# EasyEDA Pro project sfy3-v3.1.4.epro, schematic sfy3

## Sheets
1 Notecard, Antennas: Page Name: P1; Project Name: Project Name; Schematic Name: Schematic Name; Update Date: 2021.11.05; Company: EasyEDA.com; Drawn: EasyEDA; Page Size: A4; Part Number: JLCPCB-002; Reviewed: EasyEDA; Version: V0.1
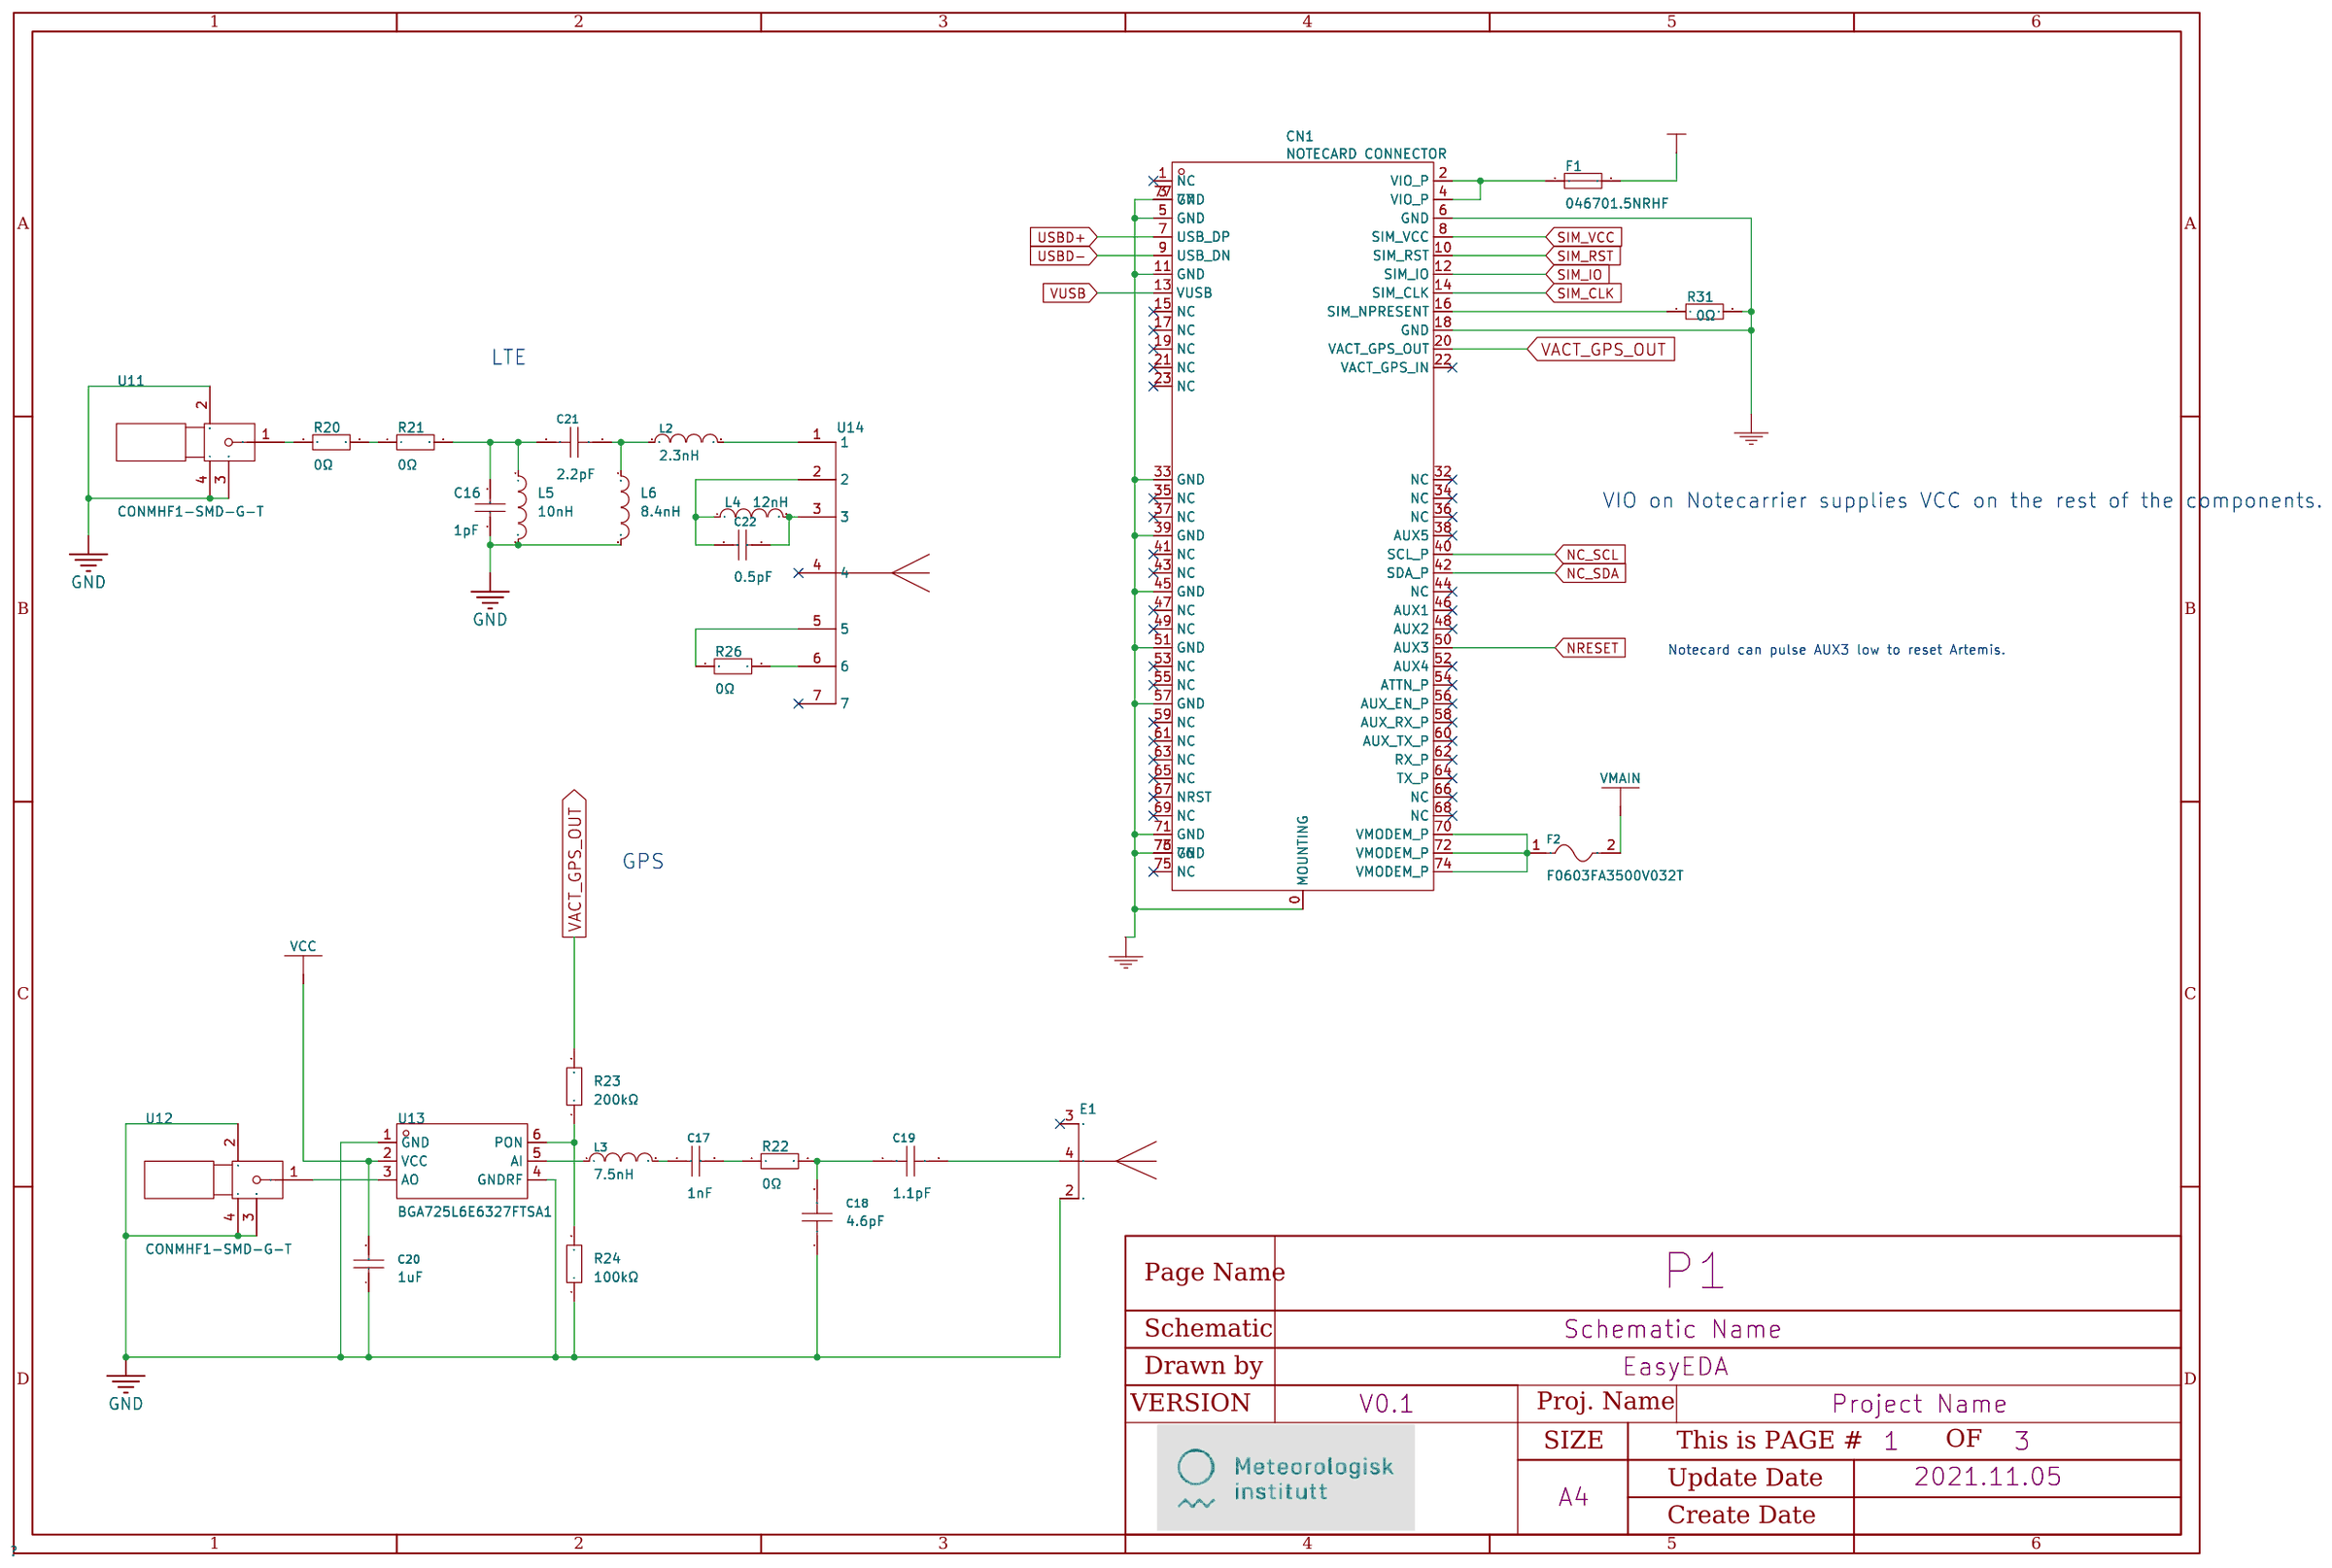
[diagram p0: Notecard, Antennas]
2 IMU, Thermistor, SD card
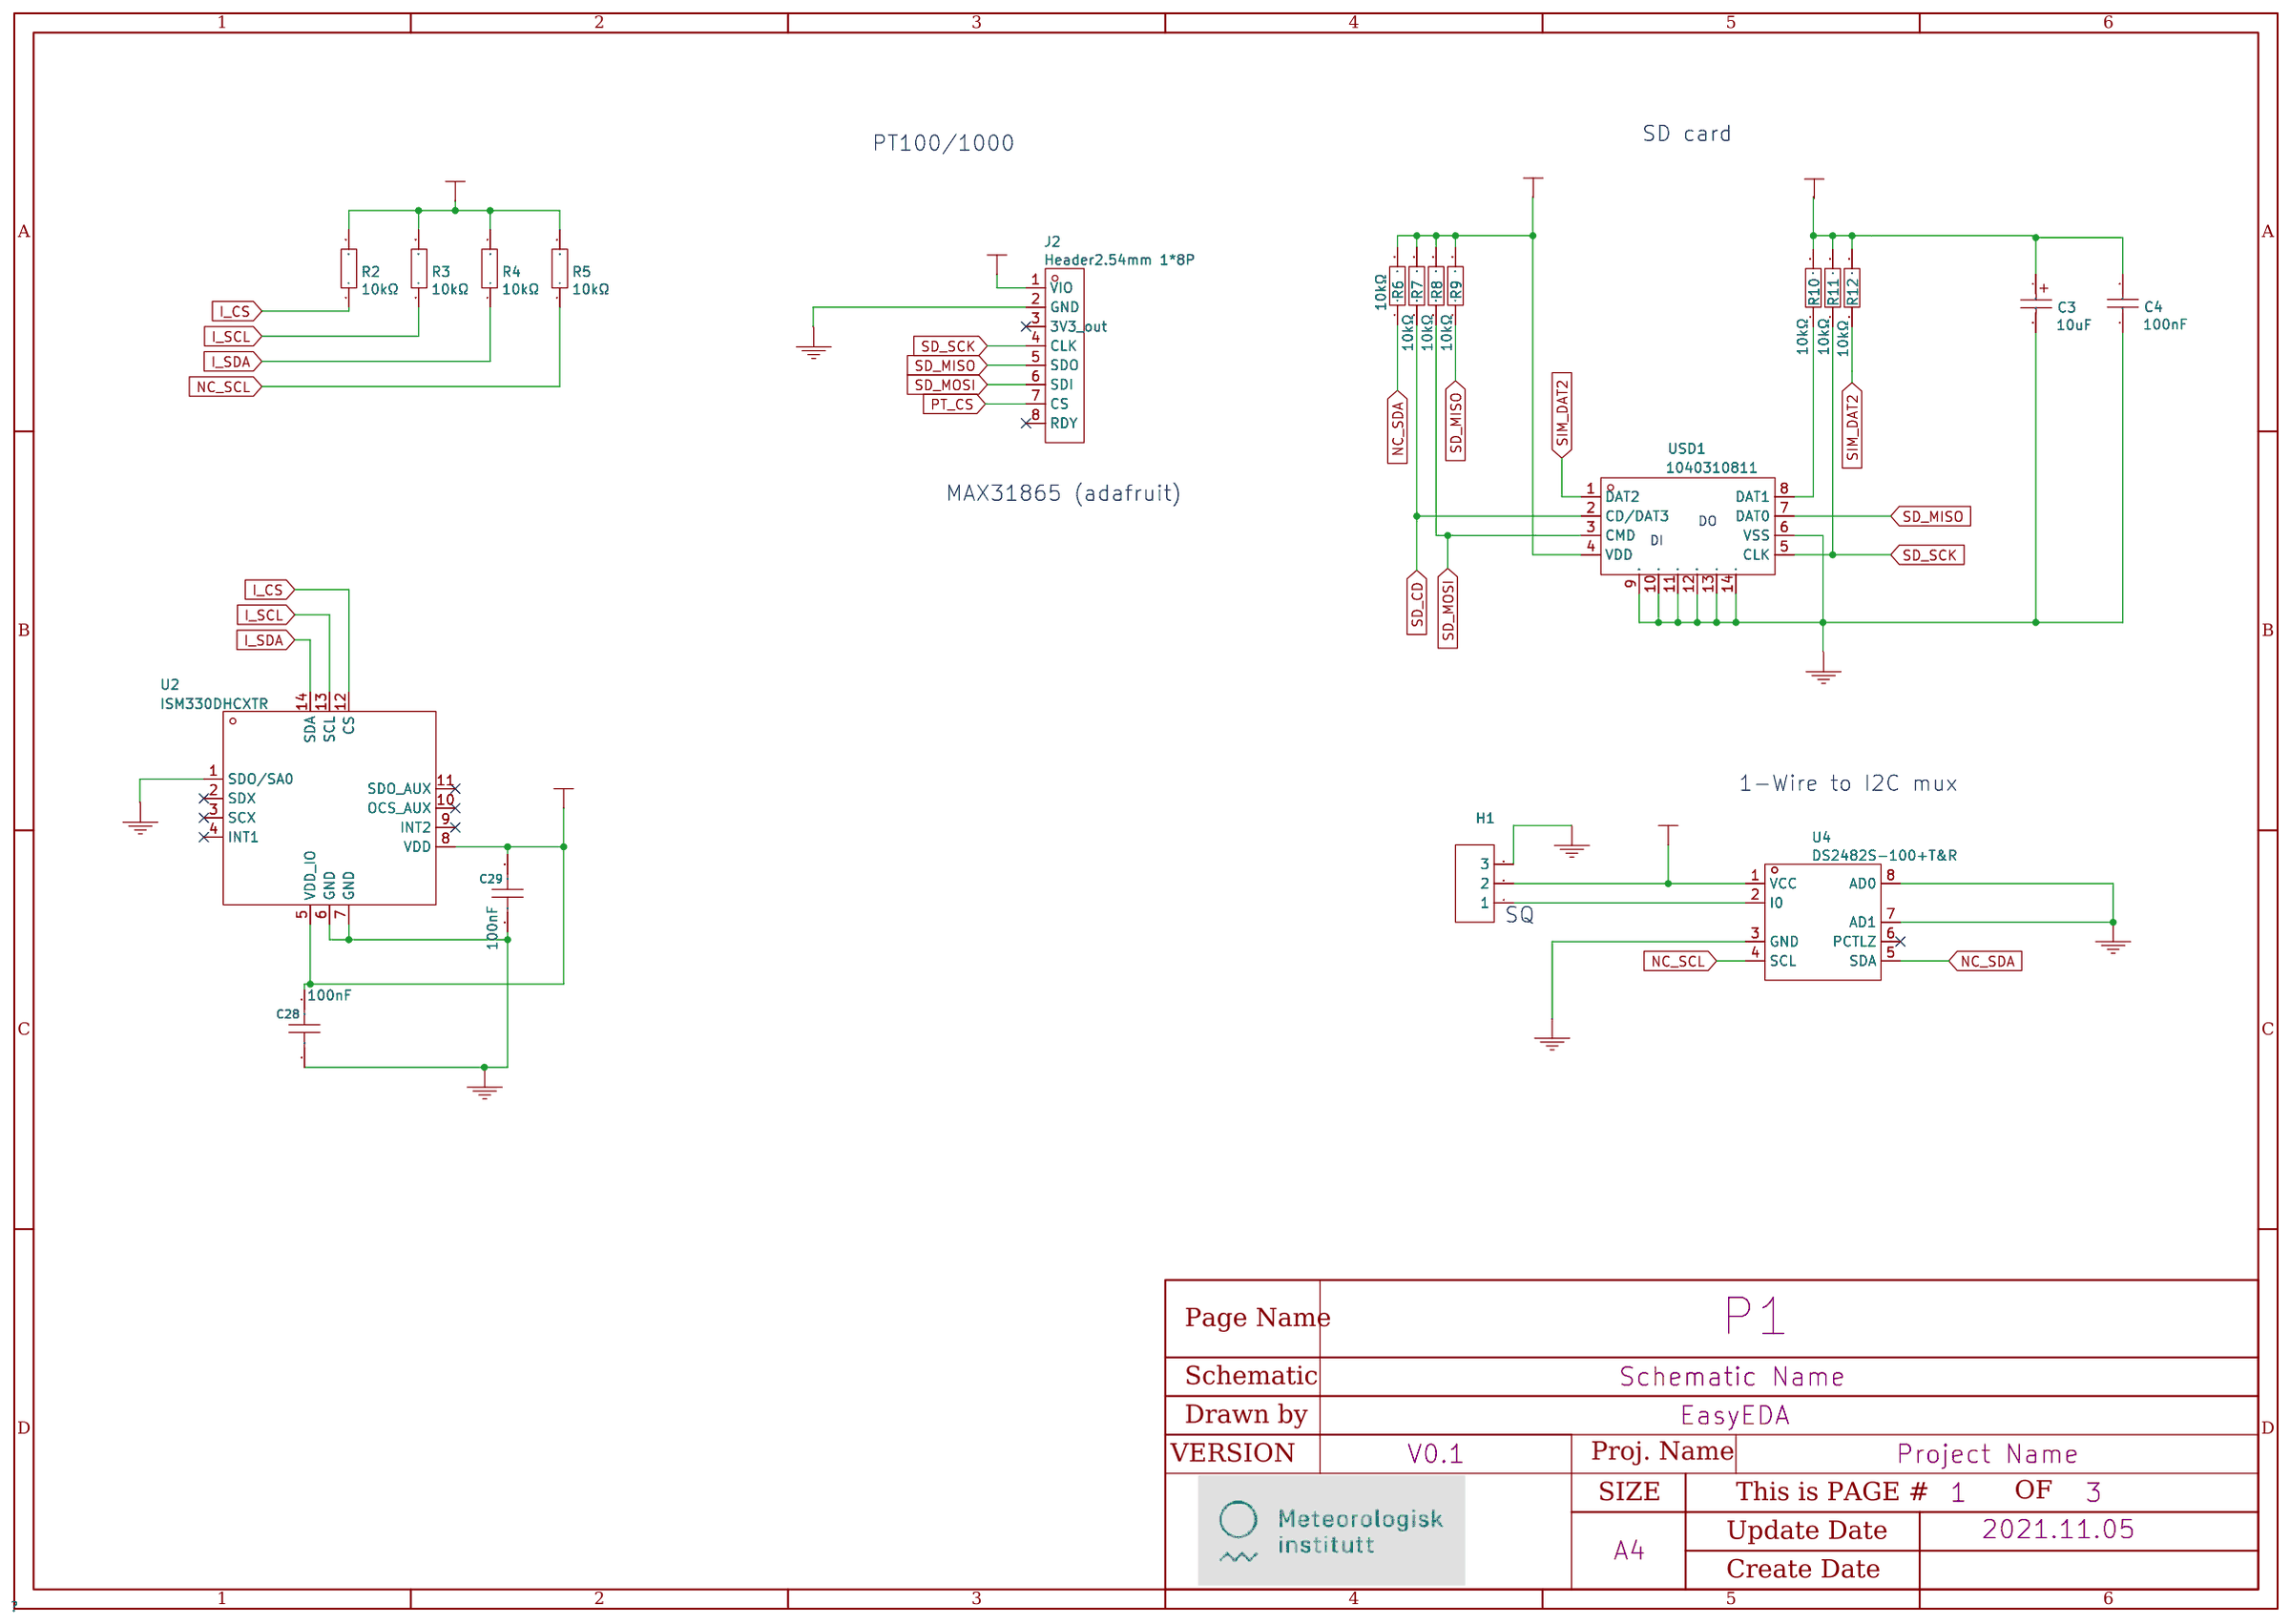
[diagram p1: IMU, Thermistor, SD card]
3 MCU (Artemis)
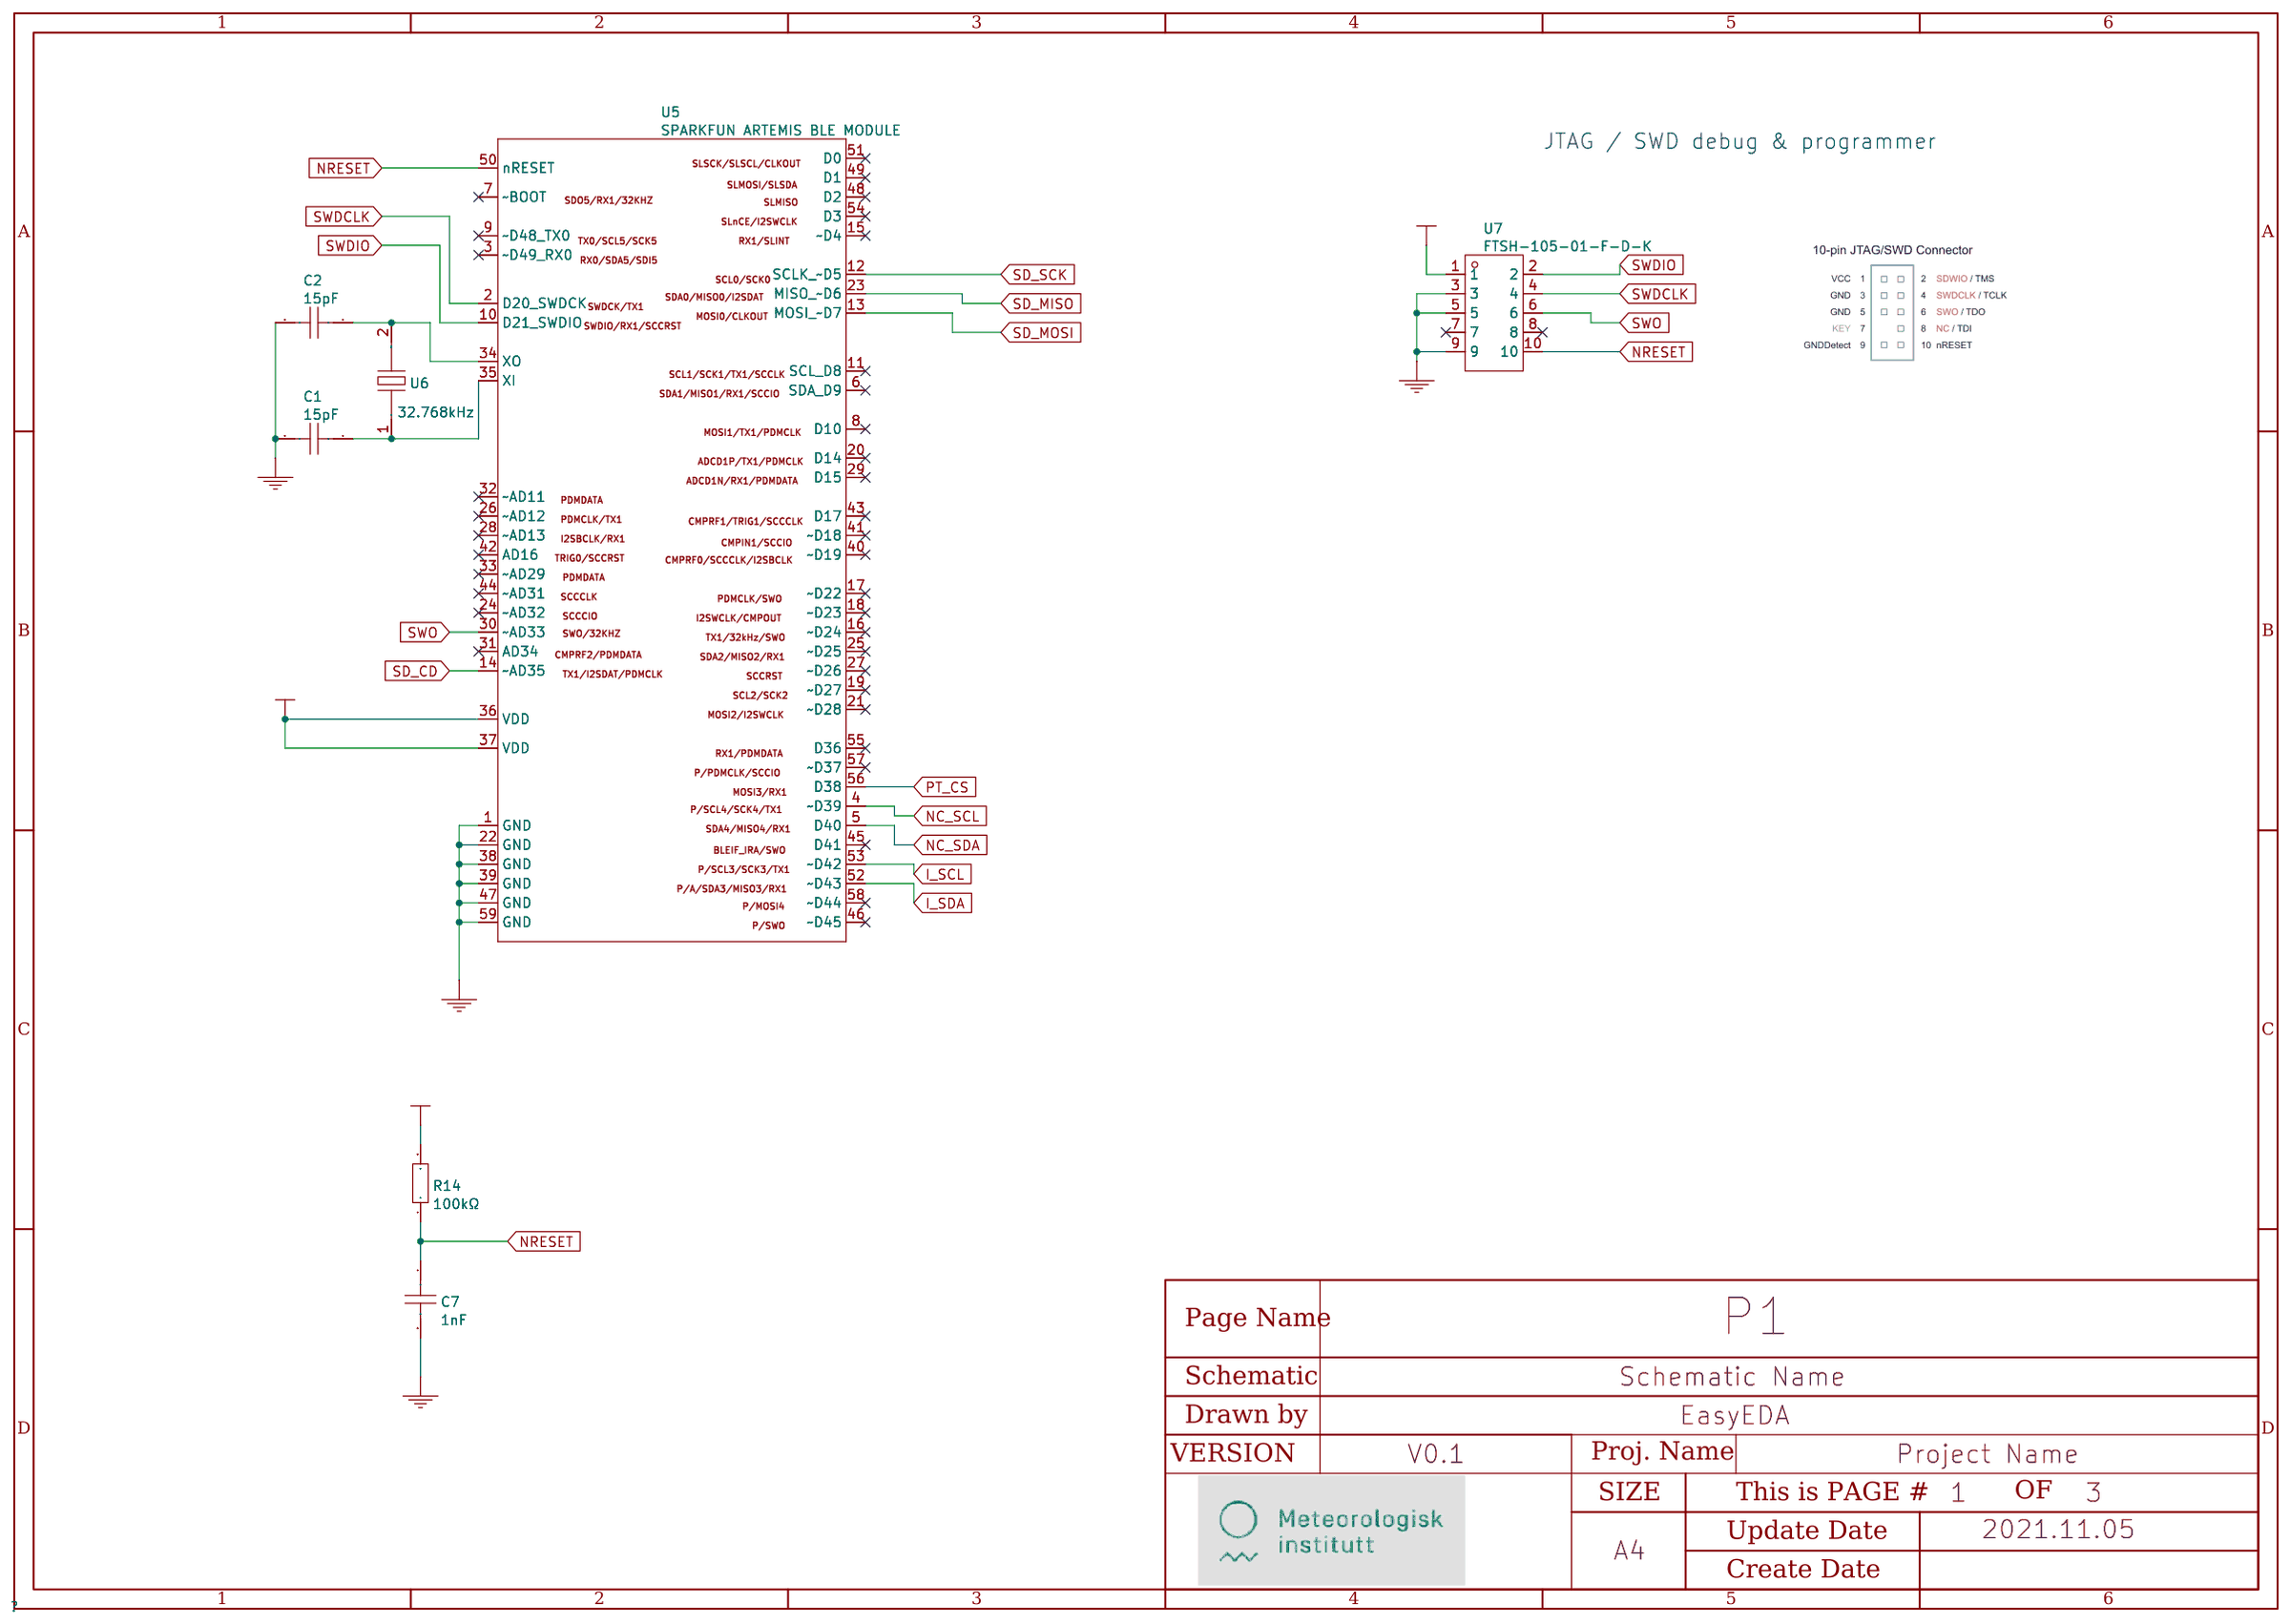
[diagram p2: MCU (Artemis)]
4 Power
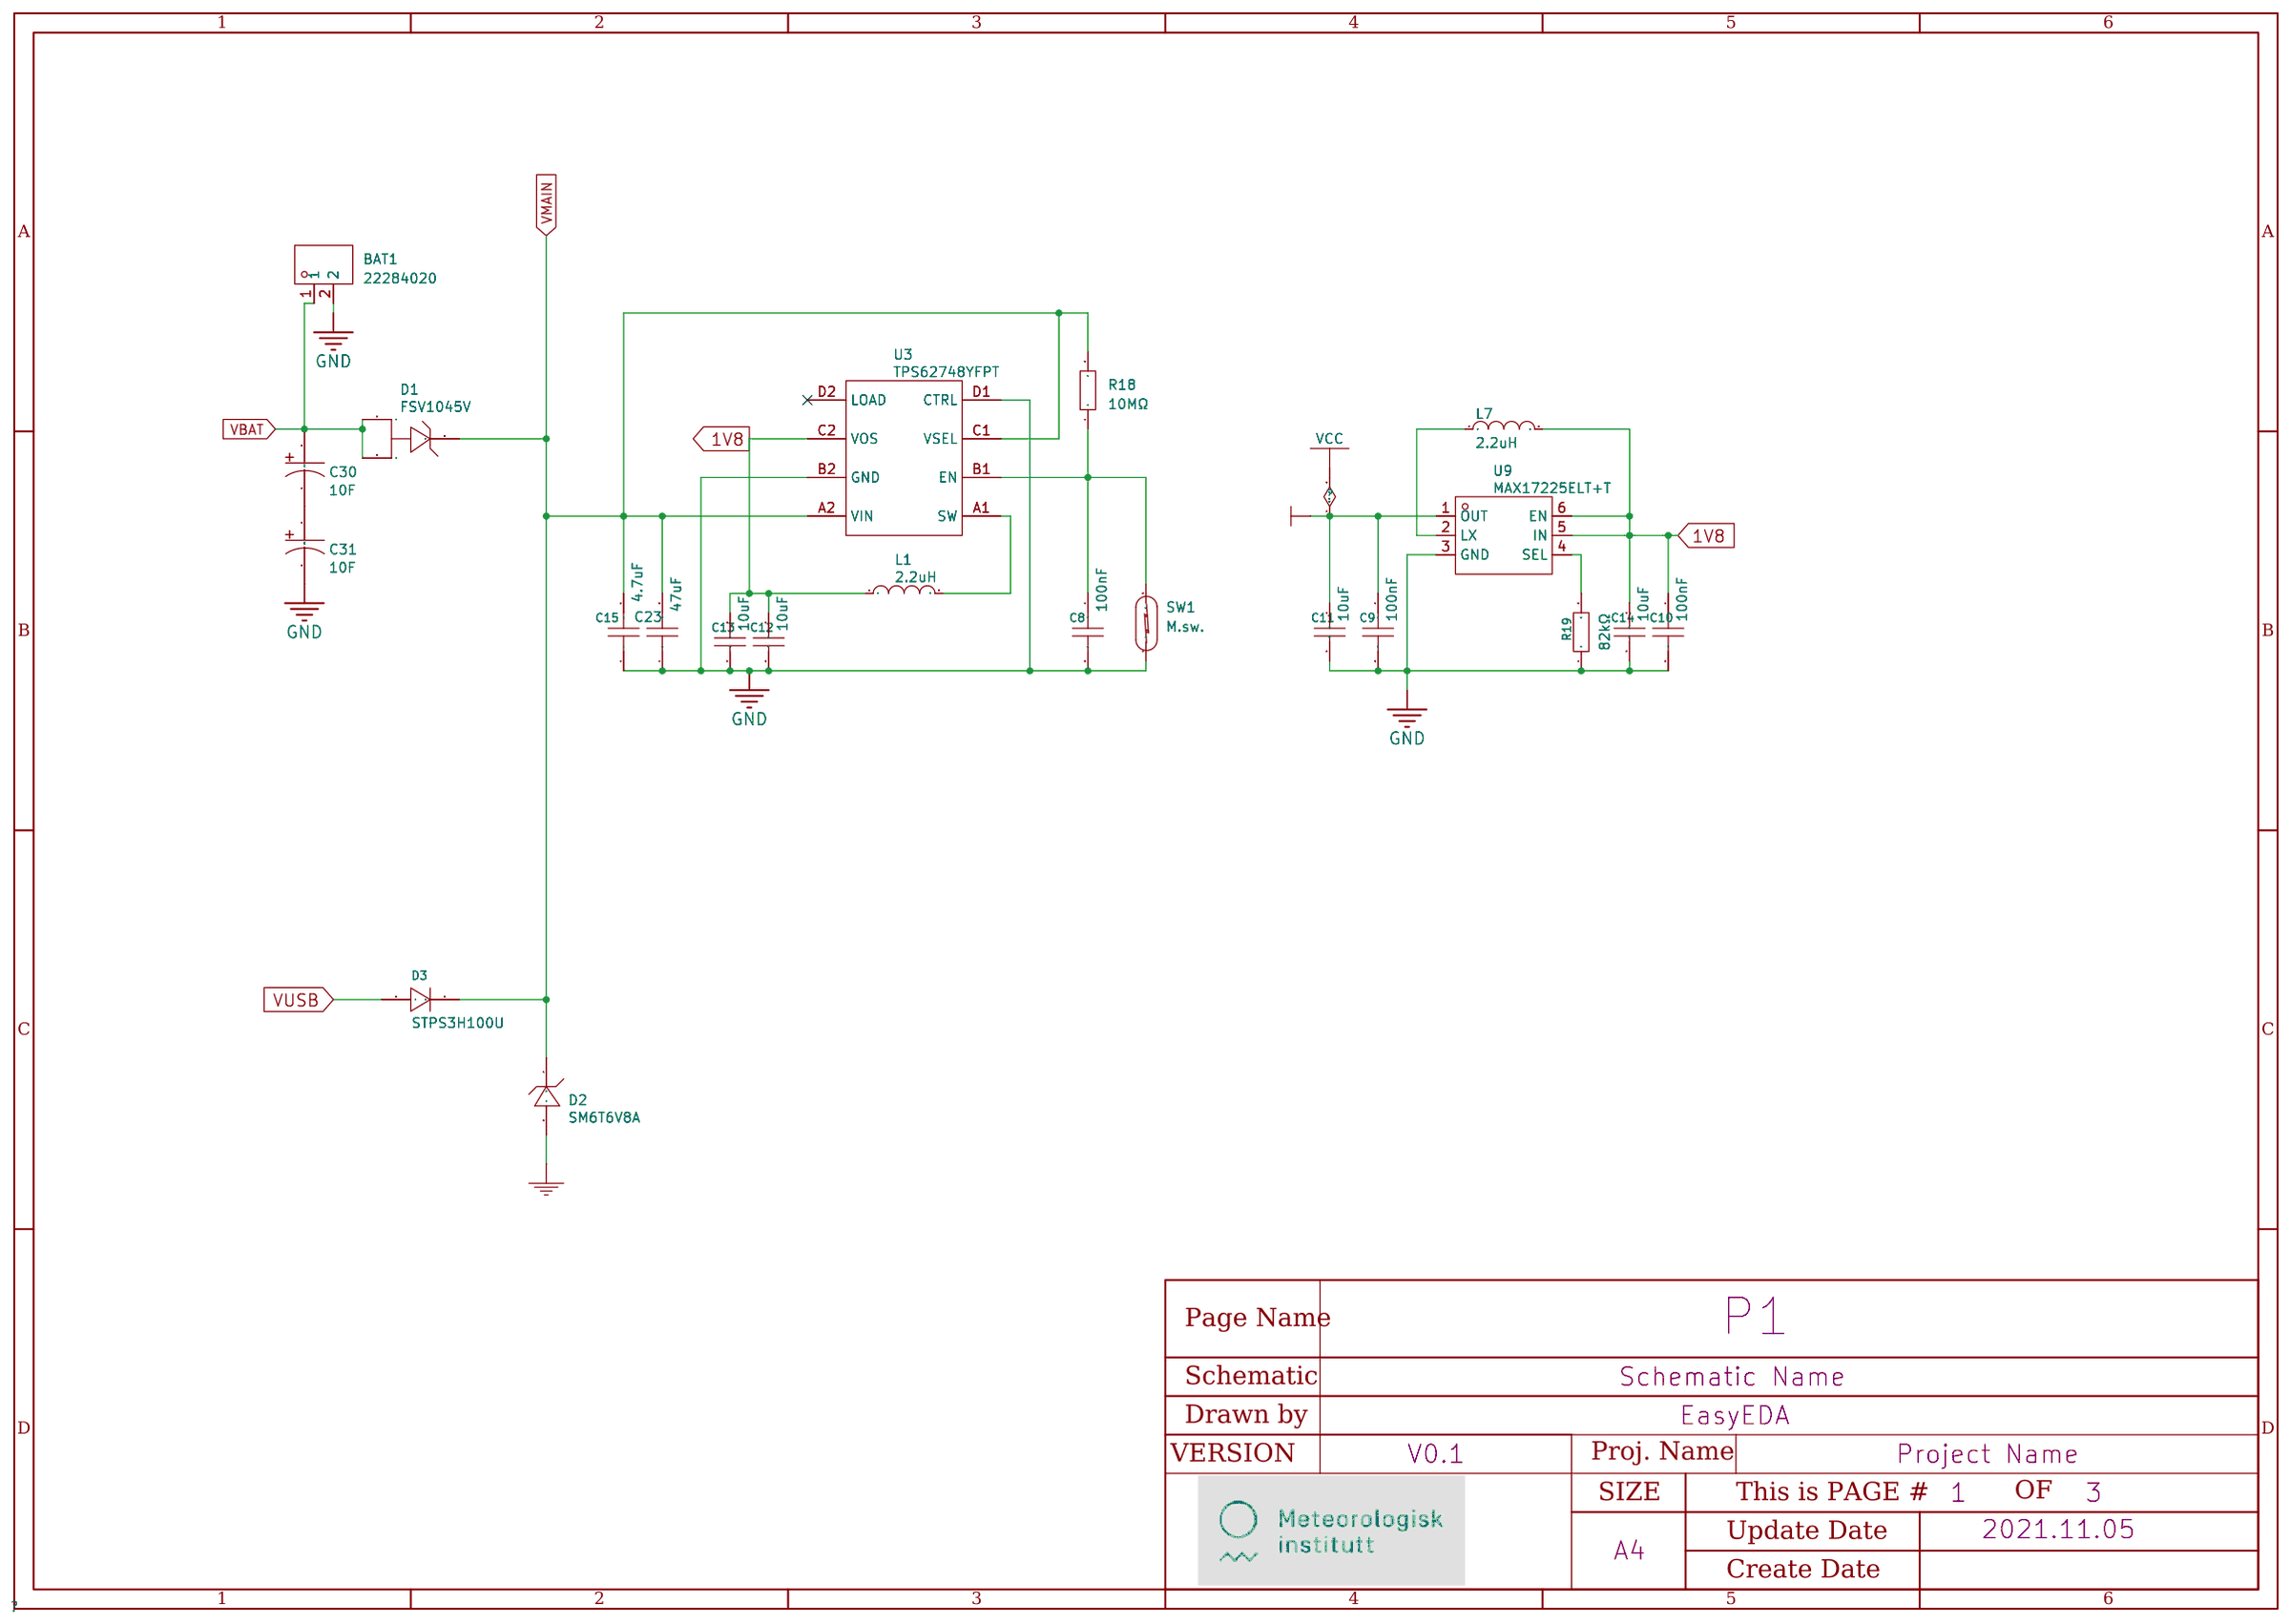
[diagram p3: Power]
5 USB, nSIM
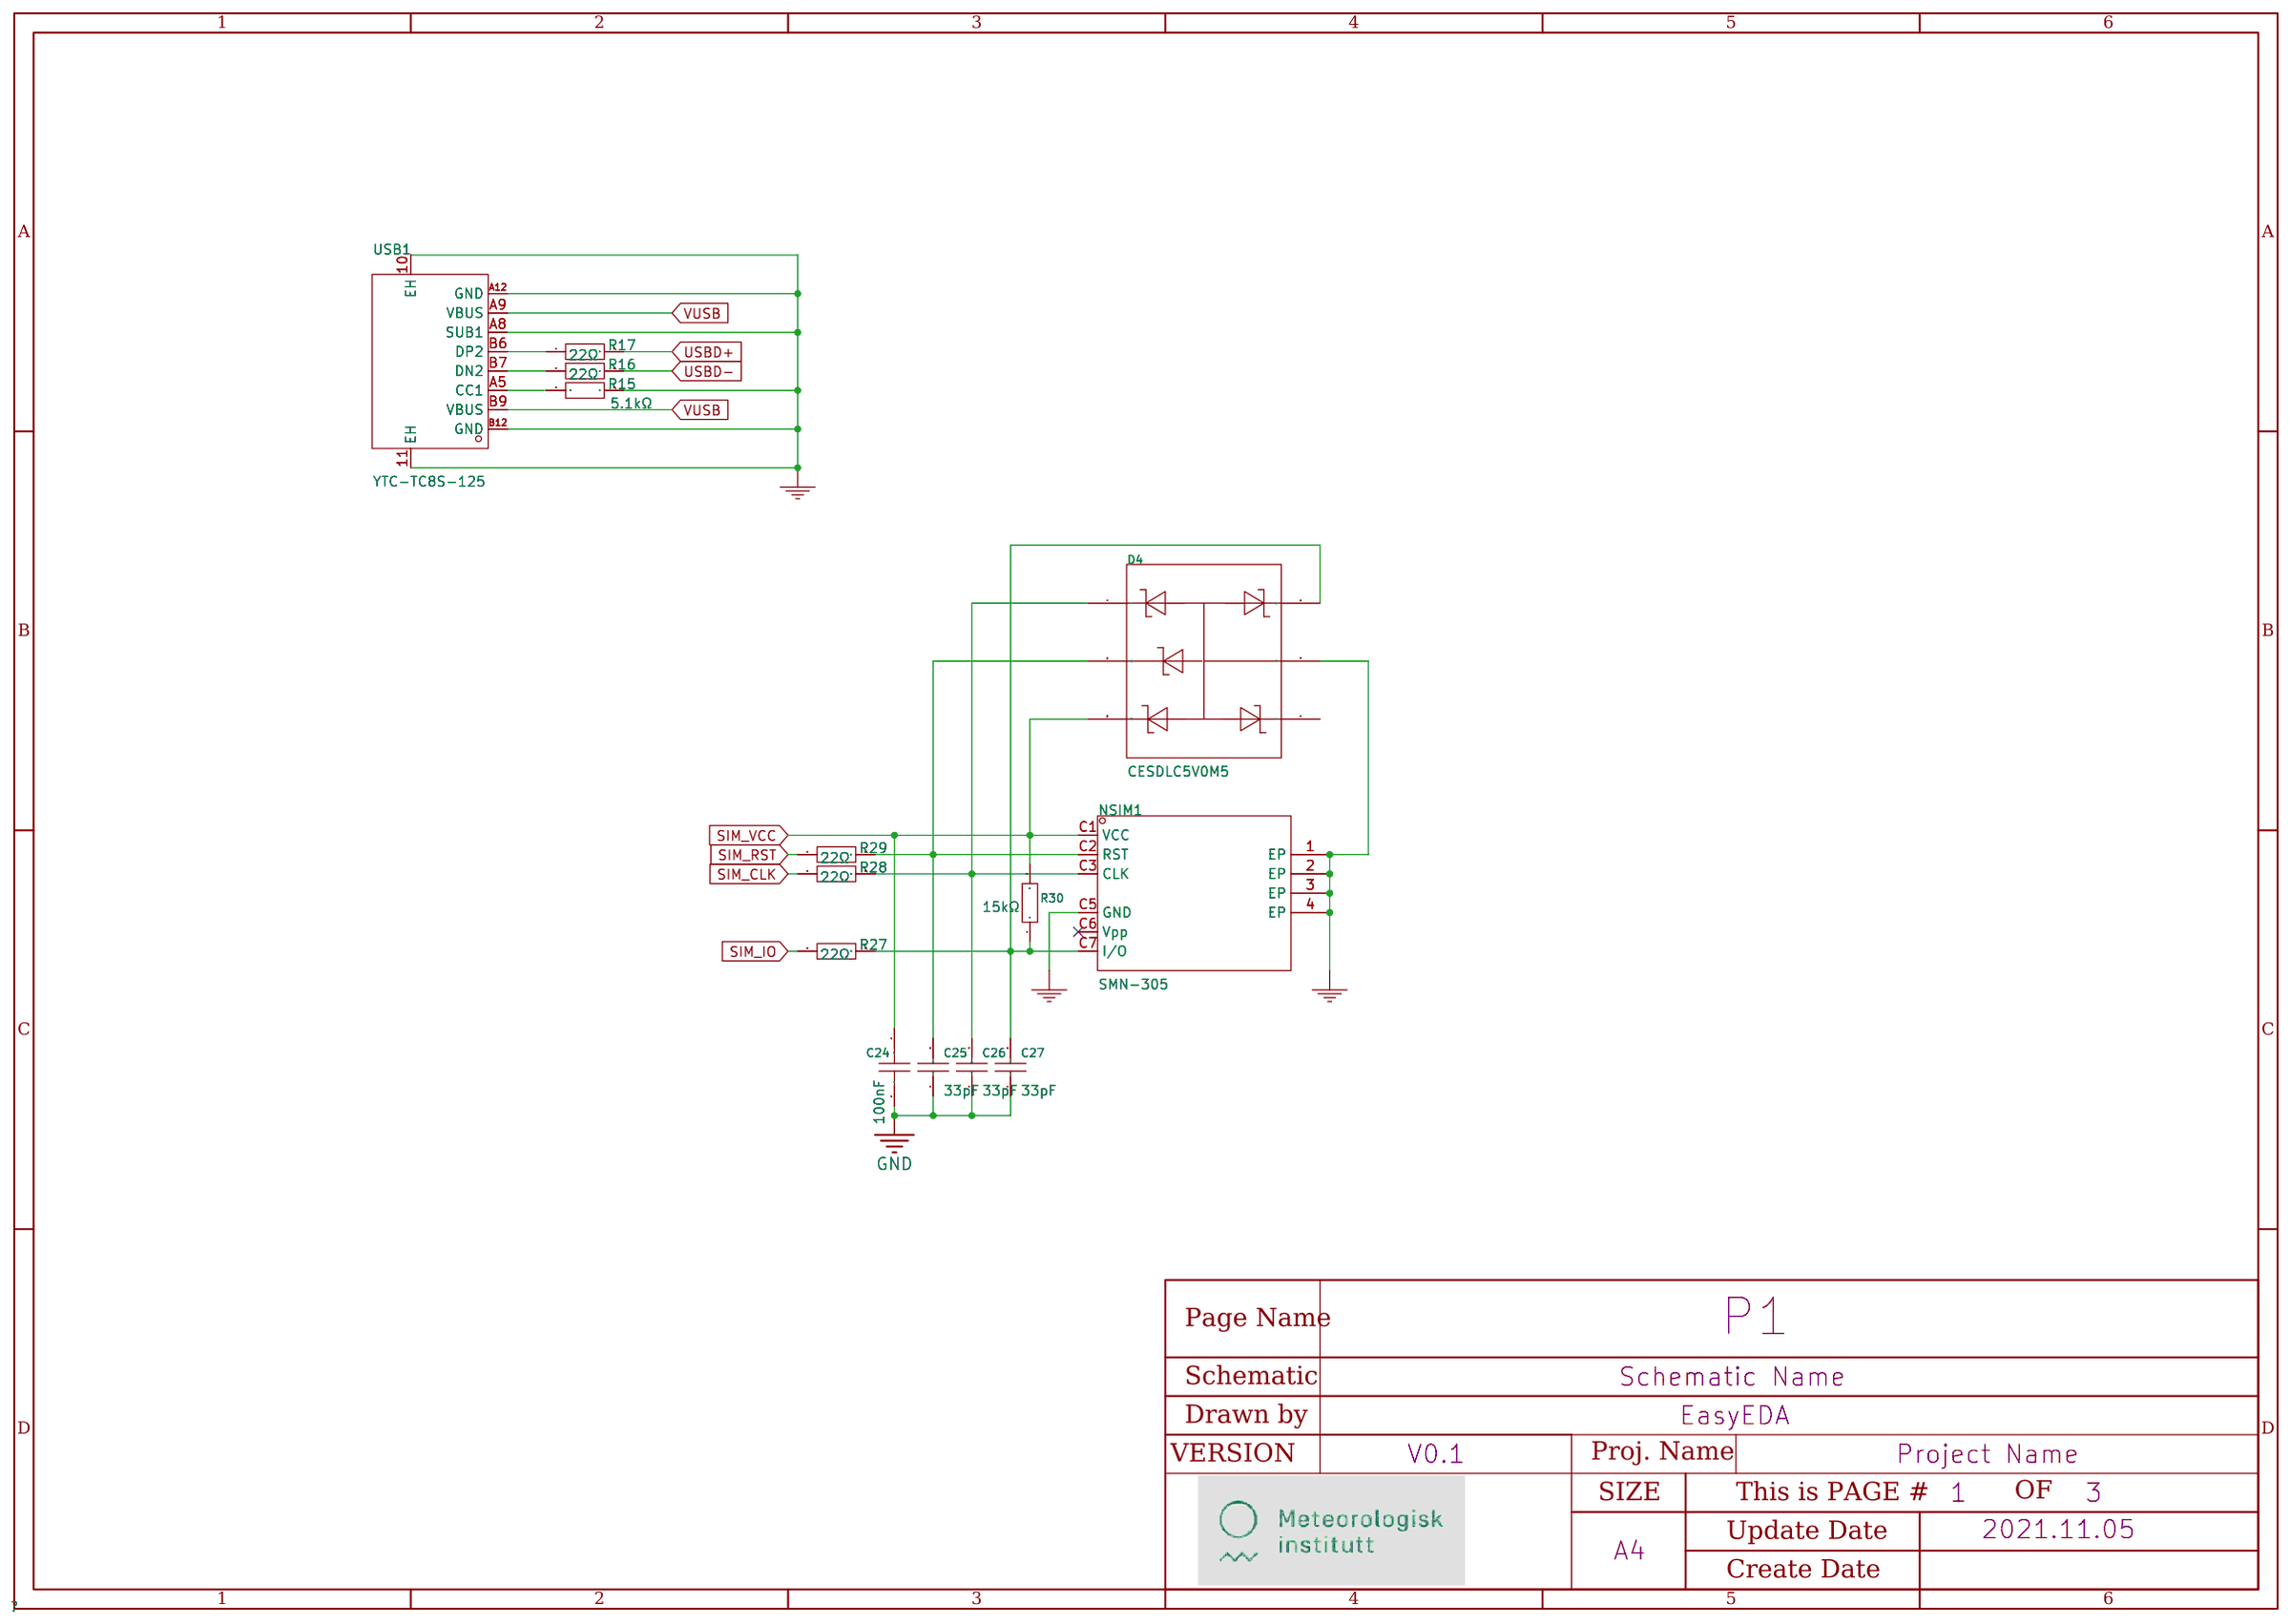
[diagram p4: USB, nSIM]

## Parts
sheet IMU, Thermistor, SD card
C3  10uF  [CAP-SMD_L3.2-W1.6-RD]
C4  100nF  [C0805]
C28  100nF  [C0402]
C29  100nF  [C0402]
H1  Header-Male-2.54_1x3  [HDR-TH_3P-P2.54-V-M-1]  (no BOM)
J2  Header2.54mm 1*8P  [HDR-TH_8P-P2.54-V-M]  (no BOM)
R2  10kΩ  [R0402]
R3  10kΩ  [R0402]
R4  10kΩ  [R0402]
R5  10kΩ  [R0402]
R6  10kΩ  [R0402]
R7  10kΩ  [R0402]
R8  10kΩ  [R0402]
R9  10kΩ  [R0402]
R10  10kΩ  [R0402]
R11  10kΩ  [R0402]
R12  10kΩ  [R0402]
U2  ISM330DHCXTR  [LGA-14_L3.0-W2.5-P0.50-BR]
U4  DS2482S-100+T&R  [SOIC-8_L4.9-W3.9-P1.27-LS6.0-BL]
USD1  1040310811  [SIM-SMD_8P-1040310811]
sheet MCU (Artemis)
C1  15pF  [C0402]
C2  15pF  [C0402]
C7  1nF  [C0805]
R14  100kΩ  [R0603]
U5  SPARKFUN ARTEMIS BLE MODULE  [ARTEMIS_BLE]
U6  32.768kHz  [CRYSTAL-SMD_L2.0-W1.2]
U7  FTSH-105-01-F-D-K  [CONN-TH_10P-P1.27_FTSH-105-01-F-D-K]
sheet Notecard, Antennas
C16  1pF  [C0402]
C17  1nF  [C0402]
C18  4.6pF  [C0402]
C19  1.1pF  [C0402]
C20  1uF  [C0402]
C21  2.2pF  [C0402]
C22  0.5pF  [C0402]
CN1  NOTECARD CONNECTOR  [NOTECARD-ext]
E1  NN03-320  [NN03-320]
F1  046701.5NRHF  [F0603]
F2  F0603FA3500V032T  [F0603]
L2  2.3nH  [L0402]
L3  7.5nH  [IND-SMD_L1.0-W0.6]
L4  12nH  [L0603]
L5  10nH  [L0603]
L6  8.4nH  [L0603]
R20  0Ω  [R0603]
R21  0Ω  [R0603]
R22  0Ω  [R0603]
R23  200kΩ  [R0402]
R24  100kΩ  [R0402]
R26  0Ω  [R0603]
R31  0Ω  [R0603]
U11  CONMHF1-SMD-G-T  [RF-SMD_CONMHF1-SMD-G-T]
U12  CONMHF1-SMD-G-T  [RF-SMD_CONMHF1-SMD-G-T]
U13  BGA725L6E6327FTSA1  [TSLP-6_L1.1-W0.7-P0.40-BR]
U14  -  [NN03-310-NoSilk]
sheet Power
BAT1  22284020  [HDR-TH_2P-P2.54-V-M-1]  (no BOM)
C8  100nF  [C0402]
C9  100nF  [C0402]
C10  100nF  [C0402]
C11  10uF  [C0402]
C12  10uF  [C0402]
C13  10uF  [C0402]
C14  10uF  [C0402]
C15  4.7uF  [C0402]
C23  47uF  [C1206]
C30  10F  [CP_12.5X20MM]
C31  10F  [CP_12.5X20MM]
D1  FSV1045V  [TO-277A_L6.1-W4.6-P2.13-LS6.5-TR]
D2  SM6T6V8A  [SMB_L4.6-W3.6-LS5.3-RD]
D3  STPS3H100U  [SMB_L4.6-W3.6-LS5.3-RD]
L1  2.2uH  [L0806]
L7  2.2uH  [IND-SMD_L4.0-W4.0_XAL4040-103]
R18  10MΩ  [R0402]
R19  82kΩ  [R0402]
SW1  M.sw.  [2P]
U3  TPS62748YFPT  [DSBGA-8_L1.6-W0.9-R2-C4-P0.40-BL]
U9  MAX17225ELT+T  [UDFN-6_L2.0-W2.0-P0.65-BL]
sheet USB, nSIM
C24  100nF  [C0402]
C25  33pF  [C0402]
C26  33pF  [C0402]
C27  33pF  [C0402]
D4  CESDLC5V0M5  [SOT-563_L1.6-W1.2-P0.50-LS1.6-BR]
NSIM1  SMN-305  [SIM-SMD_SMN-305]
R15  5.1kΩ  [R0402]
R16  22Ω  [R0402]
R17  22Ω  [R0402]
R27  22Ω  [R0402]
R28  22Ω  [R0402]
R29  22Ω  [R0402]
R30  15kΩ  [R0402]
USB1  YTC-TC8S-125  [USB-C-SMD_YIYUAN_YTC-TC8S-125]

## Library data of the parts
C3 = 10uF: Supplier: LCSC; Manufacturer: Sunlord; Manufacturer Part: TC212A106M010B; Supplier Part: C124849; JLCPCB Part Class: Extended Part
C4 = 100nF: Supplier: LCSC; Manufacturer Part: CC0805KRX7R9BB104; Manufacturer: YAGEO; Supplier Part: C49678; JLCPCB Part Class: Basic Part
C8-C10 C24 C28 C29 = CC0402KRX7R7BB104: Capacitance: Tolerance:±10% Tolerance:±10% Voltage Rated: Temperature Coefficient:; LCSC Part Name: 100nF ±10% 16V; Supplier Part: C60474; Manufacturer: YAGEO(国巨); Supplier Footprint: 0402; JLCPCB Part Class: Extended Part; Datasheet: https://atta.szlcsc.com/upload/public/pdf/source/20211223/9278FD768280B81DDBEF48FA36411A03.pdf; Supplier: LCSC; Tolerance: ±10%
H1 = Header-Male-2.54_1x3: Supplier: LCSC; Manufacturer: BOOMELE(博穆精密); Manufacturer Part: 2.54-1*3P针; Supplier Part: C49257; JLCPCB Part Class: Extended Part
J2 = Header2.54mm 1*8P: Supplier Part: C49256; Supplier: LCSC; Manufacturer: ReliaPro
R2 R5 = RC0402FR-0710KL: Type:Thick Film Resistors Resistance: Tolerance:±1% Tolerance:±1% Power(Watts): Overload Voltage (Max): Temperature Coefficient:±100ppm/℃ Temperature Coefficient:±100ppm/℃ Operating Temperature Range:-55℃~+155℃ Operating Temperature Range:-55℃~+155℃; LCSC Part Name: 厚膜电阻 10kΩ ±1% 62.5mW; Supplier Part: C60490; Manufacturer: YAGEO(国巨); Supplier Footprint: 0402; JLCPCB Part Class: Extended Part; Datasheet: https://atta.szlcsc.com/upload/public/pdf/source/20170925/C131467_1506321478108990263.pdf; Supplier: LCSC; Type: Thick Film Resistors; Tolerance: ±1%; Temperature Coefficient: ±100ppm/℃; Operating Temperature Range: -55℃~+155℃; link: https://lcsc.com/eda_search?q=C25804&%26type=1&ref=editor
R3 R4 = RC0402FR-0710KL: Type:Thick Film Resistors Resistance: Tolerance:±1% Tolerance:±1% Power(Watts): Overload Voltage (Max): Temperature Coefficient:±100ppm/℃ Temperature Coefficient:±100ppm/℃ Operating Temperature Range:-55℃~+155℃ Operating Temperature Range:-55℃~+155℃; LCSC Part Name: 厚膜电阻 10kΩ ±1% 62.5mW; Supplier Part: C60490; Manufacturer: YAGEO(国巨); Supplier Footprint: 0402; JLCPCB Part Class: Extended Part; Datasheet: https://atta.szlcsc.com/upload/public/pdf/source/20170925/C131467_1506321478108990263.pdf; Supplier: LCSC; Type: Thick Film Resistors; Tolerance: ±1%; Temperature Coefficient: ±100ppm/℃; Operating Temperature Range: -55℃~+155℃
R6-R12 = RC0402FR-0710KL: Type:Thick Film Resistors Resistance: Tolerance:±1% Tolerance:±1% Power(Watts): Overload Voltage (Max): Temperature Coefficient:±100ppm/℃ Temperature Coefficient:±100ppm/℃ Operating Temperature Range:-55℃~+155℃ Operating Temperature Range:-55℃~+155℃; LCSC Part Name: 厚膜电阻 10kΩ ±1% 62.5mW; Supplier Part: C60490; Manufacturer: YAGEO(国巨); Supplier Footprint: 0402; JLCPCB Part Class: Extended Part; Datasheet: https://atta.szlcsc.com/upload/public/pdf/source/20170925/C131467_1506321478108990263.pdf; Supplier: LCSC; Type: Thick Film Resistors; Tolerance: ±1%; Temperature Coefficient: ±100ppm/℃; Operating Temperature Range: -55℃~+155℃; link: https://lcsc.com/eda_search?q=C25804&amp;%26type=1&amp;ref=editor
U2 = ISM330DHCXTR: Supplier: LCSC; Supplier Part: C2655101; Manufacturer: ST(意法半导体); JLCPCB Part Class: Extended Part
U4 = DS2482S-100+T&R: Supplier: LCSC; Manufacturer: ADI(亚德诺)/MAXIM(美信); Manufacturer Part: DS2482S-100+T&amp;R; Supplier Part: C143306; JLCPCB Part Class: Extended Part
USD1 = 1040310811: Supplier: LCSC; Supplier Part: C585350; Manufacturer: MOLEX; JLCPCB Part Class: Extended Part
C1 C2 = 15pF: Supplier: LCSC; Supplier Part: C325460; Manufacturer: YAGEO(国巨); Manufacturer Part: CC0402GRNPO9BN150; JLCPCB Part Class: Extended Part
C7 = 1nF: Supplier: LCSC; Manufacturer: YAGEO(国巨); Manufacturer Part: CC0805KRX7R9BB102; Supplier Part: C94121; JLCPCB Part Class: Extended Part
R14 = 0603WAF1003T5E: Type:Thick Film Resistors Resistance:100kΩ Tolerance:±1% Tolerance:±1% Power(Watts): Overload Voltage (Max): Temperature Coefficient:±100ppm/℃ Temperature Coefficient:±100ppm/℃ Operating Temperature Range:-55℃~+155℃ Operating Temperature Range:-55℃~+155℃; LCSC Part Name: 100kΩ ±1% 100mW 厚膜电阻; Supplier Part: C25803; Manufacturer: UNI-ROYAL(厚声); Supplier Footprint: 0603; JLCPCB Part Class: Basic Part; Datasheet: https://atta.szlcsc.com/upload/public/pdf/source/20200306/C422600_1E6D84923E4A46A82E41ADD87F860B5C.pdf; Supplier: LCSC; Type: Thick Film Resistors; Tolerance: ±1%; Temperature Coefficient: ±100ppm/℃; Operating Temperature Range: -55℃~+155℃
U5 = SPARKFUN ARTEMIS BLE MODULE: Manufacturer: SPARKFUN; Manufacturer Part: WRL-15484; Supplier: Sparkfun; Supplier Part: WRL-15484; link: https://www.sparkfun.com/products/15484
U6 = 32.768kHz: Supplier: LCSC; Supplier Part: C5341285; Manufacturer: Micro Crystal(瑞士微晶); Manufacturer Part: CM8V-T1A-32.768KHZ-12.5PF-20PPM-TA-QC; JLCPCB Part Class: Extended Part
U7 = FTSH-105-01-F-D-K: Supplier: LCSC; Supplier Part: C9900011230; Manufacturer: null; JLCPCB Part Class: Extended Part
C16 = GJM1555C1H1R0WB01D: Capacitance: Voltage Rated: Temperature Coefficient:; LCSC Part Name: 1pF 50V ±0.05pF; Supplier Part: C72134; Manufacturer: muRata(村田); Supplier Footprint: 0402; JLCPCB Part Class: Extended Part; Datasheet: https://atta.szlcsc.com/upload/public/pdf/source/20161108/1478586454732.pdf; Supplier: LCSC
C17 = CC0402KRX7R9BB102: Capacitance: Tolerance:±10% Tolerance:±10% Voltage Rated: Temperature Coefficient:; LCSC Part Name: 1nF ±10% 50V; Supplier Part: C106205; Manufacturer: YAGEO(国巨); Supplier Footprint: 0402; JLCPCB Part Class: Extended Part; Datasheet: https://atta.szlcsc.com/upload/public/pdf/source/20181008/C309510_22F155564471FAF6A489F7D68F34234E.pdf; Supplier: LCSC; Tolerance: ±10%
C18 = CBR04C469B5GAC: Capacitance: Voltage Rated: Temperature Coefficient:; LCSC Part Name: 4.6pF 50V; Supplier Part: C600260; Manufacturer: KEMET(基美); Supplier Footprint: 0402; JLCPCB Part Class: Extended Part; Datasheet: https://atta.szlcsc.com/upload/public/pdf/source/20200414/C513330_C9B0C839AB42DCB65FF29F8BB4398565.pdf; Supplier: LCSC
C19 = GJM1555C1H1R1WB01D: Capacitance: Voltage Rated: Temperature Coefficient:; LCSC Part Name: 1.1pF 50V; Supplier Part: C88879; Manufacturer: muRata(村田); Supplier Footprint: 0402; JLCPCB Part Class: Extended Part; Datasheet: https://atta.szlcsc.com/upload/public/pdf/source/20190904/C426118_85E81C7C1F21FC87C5FB6D536E0847B4.pdf; Supplier: LCSC
C20 = CL05A105KO5NNNC: Capacitance: Tolerance:±10% Tolerance:±10% Voltage Rated: Temperature Coefficient:; LCSC Part Name: 1uF ±10% 16V; Supplier Part: C29266; Manufacturer: SAMSUNG(三星); Supplier Footprint: 0402; JLCPCB Part Class: Extended Part; Datasheet: https://atta.szlcsc.com/upload/public/pdf/source/20160218/1457707763339.pdf; Supplier: LCSC; Tolerance: ±10%
C21 = GJM1555C1H2R2WB01D: Capacitance: Voltage Rated: Temperature Coefficient:; LCSC Part Name: 2.2pF 50V; Supplier Part: C88887; Manufacturer: muRata(村田); Supplier Footprint: 0402; JLCPCB Part Class: Extended Part; Datasheet: https://atta.szlcsc.com/upload/public/pdf/source/20190904/C426118_85E81C7C1F21FC87C5FB6D536E0847B4.pdf; Supplier: LCSC
C22 = GJM1555C1HR50WB01D: Capacitance: Voltage Rated: Temperature Coefficient:; LCSC Part Name: 0.5pF 50V; Supplier Part: C76912; Manufacturer: muRata(村田); Supplier Footprint: 0402; JLCPCB Part Class: Extended Part; Datasheet: https://atta.szlcsc.com/upload/public/pdf/source/20180307/C76912_15204090800731407702.pdf; Supplier: LCSC
CN1 = NOTECARD CONNECTOR: Supplier: LCSC; Supplier Part: C2761457; Manufacturer: FOXCONN(富士康); Manufacturer Part: AS0BC21-S48BE-7H; JLCPCB Part Class: Extended Part
E1 = NN03-320: Manufacturer: Fractus Antennas S.L.; Manufacturer Part: C9900018569
F1 = 046701.5NRHF: Type:SMD Fuse Current Rating:1.5A Voltage Rating  (AC):32V Voltage Rating (DC):65V Operating Temperature:-55℃~+90℃ Operating Temperature:-55℃~+90℃ Breaking Capacity:35A；35A; LCSC Part Name: 32V贴片式保险丝; Supplier Part: C187608; Manufacturer: Littelfuse(美国力特); Supplier Footprint: 0603; JLCPCB Part Class: Extended Part; Datasheet: https://atta.szlcsc.com/upload/public/pdf/source/20180709/C206991_1939A2B48204B5461A655B76CD87198D.pdf; Supplier: LCSC; Type: SMD Fuse; Current Rating: 1.5A; Voltage Rating  (AC): 32V; Voltage Rating (DC): 65V; Operating Temperature: -55℃~+90℃; Breaking Capacity: 35A；35A
F2 = F0603FA3500V032T: Type:SMD Fuse Current Rating:3.5A Voltage Rating (DC):32V Operating Temperature:-55℃~+125℃ Operating Temperature:-55℃~+125℃ Breaking Capacity:35A; LCSC Part Name: 贴片式陶瓷保险丝; Supplier Part: C96545; Manufacturer: AEM; Supplier Footprint: 0603; JLCPCB Part Class: Extended Part; Datasheet: https://atta.szlcsc.com/upload/public/pdf/source/20170225/1488010668504.pdf; Supplier: LCSC; Type: SMD Fuse; Current Rating: 3.5A; Voltage Rating (DC): 32V; Operating Temperature: -55℃~+125℃; Breaking Capacity: 35A
L2 = LQW15AN2N3G80D: Inductance:2.3nH Tolerance:±2% Tolerance:±2% Rated Current: Saturation Current (Isat):- DC Resistance (DCR): Ratings:-; LCSC Part Name: 2.3nH ±2%; Supplier Part: C412265; Manufacturer: muRata(村田); Supplier Footprint: 0402; JLCPCB Part Class: Extended Part; Datasheet: https://atta.szlcsc.com/upload/public/pdf/source/20200107/C471381_7218EE88923040382E3940C2181C6210.pdf; Supplier: LCSC; Tolerance: ±2%
L3 = LQW15AN7N5H00D: Inductance:7.5nH Tolerance:±3% Tolerance:±3% Rated Current: Saturation Current (Isat):- DC Resistance (DCR): Ratings:-; LCSC Part Name: 7.5nH ±3%; Supplier Part: C397303; Manufacturer: muRata(村田); Supplier Footprint: 0402; JLCPCB Part Class: Extended Part; Datasheet: https://atta.szlcsc.com/upload/public/pdf/source/20191016/C437364_463D6516B3BAE72B1DA0754F3D9B8308.pdf; Supplier: LCSC; Tolerance: ±3%
L4 L6 = L_0603
L5 = L_0603: LQW18AN12NG80D
R20-R22 R26 R31 = RC0603JR-070RL: Type:Thick Film Resistors Resistance: Tolerance:±5% Tolerance:±5% Power(Watts): Overload Voltage (Max): Operating Temperature Range:-55℃~+155℃ Operating Temperature Range:-55℃~+155℃; LCSC Part Name: 厚膜电阻 0Ω ±5% 100mW; Supplier Part: C95177; Manufacturer: YAGEO(国巨); Supplier Footprint: 0603; JLCPCB Part Class: Extended Part; Datasheet: https://atta.szlcsc.com/upload/public/pdf/source/20170818/C126805_1503051298841895366.pdf; Supplier: LCSC; Type: Thick Film Resistors; Tolerance: ±5%; Operating Temperature Range: -55℃~+155℃
R23 = RC0402FR-07200KL: Type:Thick Film Resistors Resistance: Tolerance:±1% Tolerance:±1% Power(Watts): Overload Voltage (Max): Temperature Coefficient:±100ppm/℃ Temperature Coefficient:±100ppm/℃ Operating Temperature Range:-55℃~+155℃ Operating Temperature Range:-55℃~+155℃; LCSC Part Name: 厚膜电阻 200kΩ ±1% 62.5mW; Supplier Part: C114763; Manufacturer: YAGEO(国巨); Supplier Footprint: 0402; JLCPCB Part Class: Extended Part; Datasheet: https://atta.szlcsc.com/upload/public/pdf/source/20180821/C275644_0D56F95EFF785E7D9A1FEF436B37DA78.pdf; Supplier: LCSC; Type: Thick Film Resistors; Tolerance: ±1%; Temperature Coefficient: ±100ppm/℃; Operating Temperature Range: -55℃~+155℃
R24 = RC0402FR-07100KL: Type:Thick Film Resistors Resistance: Tolerance:±1% Tolerance:±1% Power(Watts): Overload Voltage (Max): Temperature Coefficient:±100ppm/℃ Temperature Coefficient:±100ppm/℃ Operating Temperature Range:-55℃~+155℃ Operating Temperature Range:-55℃~+155℃; LCSC Part Name: 厚膜电阻 100kΩ ±1% 62.5mW; Supplier Part: C60491; Manufacturer: YAGEO(国巨); Supplier Footprint: 0402; JLCPCB Part Class: Extended Part; Datasheet: https://atta.szlcsc.com/upload/public/pdf/source/20180927/C295883_E8D83085EA81BD7DE0B2B681138C15EE.pdf; Supplier: LCSC; Type: Thick Film Resistors; Tolerance: ±1%; Temperature Coefficient: ±100ppm/℃; Operating Temperature Range: -55℃~+155℃
U11 U12 = CONMHF1-SMD-G-T: Connector Type:板端 Number of Ports:1 Frequency-Max:6GHz RF Series:IPEX Impedance:50Ω Contact Material:Copper Alloy Contact Plating:Gold Operating Temperature Range:-65℃~+165℃ Operating Temperature Range:-65℃~+165℃; LCSC Part Name: IPEX; Supplier Part: C3174614; Manufacturer: Linx; JLCPCB Part Class: Extended Part; Supplier: LCSC; Connector Type: 板端; Number of Ports: 1; Frequency-Max: 6GHz; RF Series: IPEX; Impedance: 50Ω; Contact Material: Copper Alloy; Contact Plating: Gold; Operating Temperature Range: -65℃~+165℃
U13 = BGA725L6E6327FTSA1: Applications:GPS,GNSS Frequency Range:1.55GHz~1.615GHz Frequency Range:1.55GHz~1.615GHz Gain:20dB Noise Figure:0.65dB Supply Voltage:1.5V~3.6V Supply Voltage:1.5V~3.6V Supply Current:3.6mA; Supplier Part: C2649466; Manufacturer: Infineon(英飞凌); Supplier Footprint: DFN-6(0.7x1.1); JLCPCB Part Class: Extended Part; Datasheet: https://atta.szlcsc.com/upload/public/pdf/source/20211206/2E6B0317A65C39FEDF5554E21B6728AE.pdf; Supplier: LCSC; Applications: GPS,GNSS; Frequency Range: 1.55GHz~1.615GHz; Gain: 20dB; Noise Figure: 0.65dB; Supply Voltage: 1.5V~3.6V; Supply Current: 3.6mA
U14 = NN03-310
BAT1 = 22284020: Pin Structure:1x2P Pitch:2.54mm Row Spacing:- Circluar Pins/Square Pins:Square Pins Mounting Type:Straight Number of Rows:Plugin Number of Pins:2P Current Rating (Max):- Voltage Rating (Max):- Length of Mating Pin:- Insulation Height:- Contact Material: C; LCSC Part Name: 间距:2.54mm 1x2P 直插 方针; Supplier Part: C234182; Manufacturer: MOLEX; Supplier Footprint: 插件,P=2.54mm; JLCPCB Part Class: Extended Part; Datasheet: https://atta.szlcsc.com/upload/public/pdf/source/20180801/C234182_F77B1C2A9EF8AC9B34CEB7670B45930E.pdf; Supplier: LCSC; Pin Structure: 1x2P; Pitch: 2.54mm; Circluar Pins/Square Pins: Square Pins; Mounting Type: Straight; Number of Rows: Plugin; Number of Pins: 2P; Color: Black
C11-C14 = GRM155R60J106ME44D: Capacitance: Tolerance:±20% Tolerance:±20% Voltage Rated: Temperature Coefficient:; LCSC Part Name: 10uF ±20% 6.3V; Supplier Part: C76991; Manufacturer: muRata(村田); Supplier Footprint: 0402; JLCPCB Part Class: Extended Part; Datasheet: https://atta.szlcsc.com/upload/public/pdf/source/20200305/C490387_23319AE8C154DEB24C505E6C82A8106A.pdf; Supplier: LCSC; Tolerance: ±20%
C15 = JMK105BBJ475MV-F: Capacitance: Tolerance:±20% Tolerance:±20% Voltage Rated: Temperature Coefficient:; LCSC Part Name: 4.7uF ±20% 6.3V; Supplier Part: C87147; Manufacturer: TAIYO YUDEN(太诱); Supplier Footprint: 0402; JLCPCB Part Class: Extended Part; Datasheet: https://atta.szlcsc.com/upload/public/pdf/source/20210525/C2802164_C0429B055888A674C3F00BA74B841C5B.pdf; Supplier: LCSC; Tolerance: ±20%
C23 = C3216X5R1E476M160AC: Capacitance: Tolerance:±20% Tolerance:±20% Voltage Rated: Temperature Coefficient:; LCSC Part Name: 47uF ±20% 25V; Supplier Part: C2167787; Manufacturer: TDK; Supplier Footprint: 1206; JLCPCB Part Class: Extended Part; Datasheet: https://atta.szlcsc.com/upload/public/pdf/source/20210430/12912E3792F621391F28022904E5A4A4.pdf; Supplier: LCSC; Tolerance: ±20%
C30 C31 = 10F: Supplier Part: 581-SCCT20B106PRB; Supplier: Mouser; Manufacturer: AVX; Manufacturer Part: SCCT20B106PRB; Link: https://www.mouser.com/datasheet/2/40/AVX-SCC-1018831.pdf
D1 = FSV1045V: Supplier: LCSC; Supplier Part: C895433; Manufacturer: onsemi(安森美); JLCPCB Part Class: Extended Part
D2 = SM6T6V8A: Supplier: LCSC; Supplier Part: C84316; Manufacturer: ST(意法半导体); JLCPCB Part Class: Extended Part
D3 = STPS3H100U: Forward Voltage (Vf@If):840mV@3A Reverse Voltage (Vr):100V Average Rectified Current (Io):3A Reverse Leakage Current (Ir):1uA@100V; LCSC Part Name: 电压:100V 电流:3A; Supplier Part: C283521; Manufacturer: ST(意法半导体); Supplier Footprint: SMB; JLCPCB Part Class: Extended Part; Datasheet: https://atta.szlcsc.com/upload/public/pdf/source/20181022/C283521_49DF33C1F0BFD183278876FE1ED2D806.pdf; Supplier: LCSC; Forward Voltage (Vf@If): 840mV@3A; Reverse Voltage (Vr): 100V; Average Rectified Current (Io): 3A; Reverse Leakage Current (Ir): 1uA@100V
L1 = 2.2uH: Supplier: LCSC; Supplier Part: C2041613; Manufacturer: muRata(村田); Manufacturer Part: 1285AS-H-2R2M=P2; JLCPCB Part Class: Extended Part
L7 = XGL4020-222MEC: Inductance: Tolerance:±20% Tolerance:±20% Saturation Current (Isat):6.2A DC Resistance (DCR): Ratings:AEC-Q200; LCSC Part Name: 2.2uH ±20% 6.2A; Supplier Part: C6012410; Manufacturer: Coilcraft(线艺); Supplier Footprint: 1616; JLCPCB Part Class: Extended Part; Datasheet: https://atta.szlcsc.com/upload/public/pdf/source/231023/xgl4020-3a114aaf374001a9337ca5718a01a6f3.pdf; Supplier: LCSC; Tolerance: ±20%; Saturation Current (Isat): 6.2A; Ratings: AEC-Q200
R18 = RC0402JR-0710ML: Type:Thick Film Resistors Resistance: Tolerance:±5% Tolerance:±5% Power(Watts): Overload Voltage (Max): Temperature Coefficient:±100ppm/℃ Temperature Coefficient:±100ppm/℃ Operating Temperature Range:-55℃~+155℃ Operating Temperature Range:-55℃~+155℃; LCSC Part Name: 厚膜电阻 10MΩ ±5% 62.5mW; Supplier Part: C274900; Manufacturer: YAGEO(国巨); Supplier Footprint: 0402; JLCPCB Part Class: Extended Part; Datasheet: https://atta.szlcsc.com/upload/public/pdf/source/20180821/C275644_0D56F95EFF785E7D9A1FEF436B37DA78.pdf; Supplier: LCSC; Type: Thick Film Resistors; Tolerance: ±5%; Temperature Coefficient: ±100ppm/℃; Operating Temperature Range: -55℃~+155℃
R19 = 0402WGF8202TCE: Type:Thick Film Resistors Resistance:82kΩ Tolerance:±1% Tolerance:±1% Power(Watts): Overload Voltage (Max): Temperature Coefficient:±100ppm/℃ Temperature Coefficient:±100ppm/℃ Operating Temperature Range:-55℃~+155℃ Operating Temperature Range:-55℃~+155℃; LCSC Part Name: 82kΩ ±1% 62.5mW 厚膜电阻; Supplier Part: C4142; Manufacturer: UNI-ROYAL(厚声); Supplier Footprint: 0402; JLCPCB Part Class: Extended Part; Datasheet: https://atta.szlcsc.com/upload/public/pdf/source/20200306/C422600_1E6D84923E4A46A82E41ADD87F860B5C.pdf; Supplier: LCSC; Type: Thick Film Resistors; Tolerance: ±1%; Temperature Coefficient: ±100ppm/℃; Operating Temperature Range: -55℃~+155℃
SW1 = M.sw.: license: https://www.gnu.org/licenses/lgpl-2.1.html
U3 = TPS62748YFPT: Supplier: LCSC; Manufacturer: TI(德州仪器); Supplier Part: C133949; JLCPCB Part Class: Extended Part
U9 = MAX17225ELT+T: Supplier: LCSC; Supplier Part: C2071569; Manufacturer: ADI(亚德诺)/MAXIM(美信); JLCPCB Part Class: Extended Part
C25-C27 = CC0402JRNPO9BN330: Capacitance: Tolerance:±5% Tolerance:±5% Voltage Rated: Temperature Coefficient:; LCSC Part Name: 33pF ±5% 50V; Supplier Part: C107005; Manufacturer: YAGEO(国巨); Supplier Footprint: 0402; JLCPCB Part Class: Extended Part; Datasheet: https://atta.szlcsc.com/upload/public/pdf/source/20181008/C309499_21CC21451B82C39E3D92150FD6B30293.pdf; Supplier: LCSC; Tolerance: ±5%
D4 = CESDLC5V0M5: polarity:Bi-Directional Reverse Stand-Off Voltage (Vrwm):5V Maximum Clamping Voltage:13V Peak Pulse Current (Ipp)@10/1000us:2.5A Breakdown Voltage:6.2V Type:ESD; LCSC Part Name: 双向ESD; Supplier Part: C119071; Manufacturer: CJ(江苏长电/长晶); Supplier Footprint: SOT-563; JLCPCB Part Class: Extended Part; Datasheet: https://atta.szlcsc.com/upload/public/pdf/source/20170717/C119071_1500269972586820776.pdf; Supplier: LCSC; polarity: Bi-Directional; Reverse Stand-Off Voltage (Vrwm): 5V; Maximum Clamping Voltage: 13V; Peak Pulse Current (Ipp)@10/1000us: 2.5A; Breakdown Voltage: 6.2V; Type: ESD
NSIM1 = SMN-305: Card Connection Mode:Clamshell Card Type:NanoSIM卡 Connector Type:Deck Body Height (Max):1.4mm Contact Material:Phosphor coppe Contact Plating:Gold Operating Temperature Range:-25℃~+85℃ Operating Temperature Range:-25℃~+85℃ Soldering Temperature(Max):260℃; LCSC Part Name: 翻盖式 NanoSIM卡 卡座; Supplier Part: C266890; Manufacturer: XUNPU(讯普); Supplier Footprint: SMD; JLCPCB Part Class: Extended Part; Datasheet: https://atta.szlcsc.com/upload/public/pdf/source/20201231/C266890_AC9AEDEE27E91F42B31BC81B42E52BE3.pdf; Supplier: LCSC; Card Connection Mode: Clamshell; Card Type: NanoSIM卡; Connector Type: Deck; Body Height (Max): 1.4mm; Contact Material: Phosphor coppe; Contact Plating: Gold; Operating Temperature Range: -25℃~+85℃; Soldering Temperature(Max): 260℃
R15 = 0402WGF5101TCE: Type:Thick Film Resistors Resistance:5.1kΩ Tolerance:±1% Tolerance:±1% Power(Watts): Overload Voltage (Max): Temperature Coefficient:±100ppm/℃ Temperature Coefficient:±100ppm/℃ Operating Temperature Range:-55℃~+155℃ Operating Temperature Range:-55℃~+155℃; LCSC Part Name: 5.1kΩ ±1% 62.5mW 厚膜电阻; Supplier Part: C25905; Manufacturer: UNI-ROYAL(厚声); Supplier Footprint: 0402; JLCPCB Part Class: Basic Part; Datasheet: https://atta.szlcsc.com/upload/public/pdf/source/20200306/C422600_1E6D84923E4A46A82E41ADD87F860B5C.pdf; Supplier: LCSC; Type: Thick Film Resistors; Tolerance: ±1%; Temperature Coefficient: ±100ppm/℃; Operating Temperature Range: -55℃~+155℃
R16 R17 R27-R29 = 0402WGF220JTCE: Type:Thick Film Resistors Resistance:22Ω Tolerance:±1% Tolerance:±1% Power(Watts): Overload Voltage (Max): Temperature Coefficient:±100ppm/℃ Temperature Coefficient:±100ppm/℃ Operating Temperature Range:-55℃~+155℃ Operating Temperature Range:-55℃~+155℃; LCSC Part Name: 22Ω ±1% 62.5mW 厚膜电阻; Supplier Part: C25092; Manufacturer: UNI-ROYAL(厚声); Supplier Footprint: 0402; JLCPCB Part Class: Basic Part; Datasheet: https://atta.szlcsc.com/upload/public/pdf/source/20200306/C422600_1E6D84923E4A46A82E41ADD87F860B5C.pdf; Supplier: LCSC; Type: Thick Film Resistors; Tolerance: ±1%; Temperature Coefficient: ±100ppm/℃; Operating Temperature Range: -55℃~+155℃
R30 = 0402WGF1502TCE: Type:Thick Film Resistors Resistance:15kΩ Tolerance:±1% Tolerance:±1% Power(Watts): Overload Voltage (Max): Temperature Coefficient:±100ppm/℃ Temperature Coefficient:±100ppm/℃ Operating Temperature Range:-55℃~+155℃ Operating Temperature Range:-55℃~+155℃; LCSC Part Name: 15kΩ ±1% 62.5mW 厚膜电阻; Supplier Part: C25756; Manufacturer: UNI-ROYAL(厚声); Supplier Footprint: 0402; JLCPCB Part Class: Basic Part; Datasheet: https://atta.szlcsc.com/upload/public/pdf/source/20200306/C422600_1E6D84923E4A46A82E41ADD87F860B5C.pdf; Supplier: LCSC; Type: Thick Film Resistors; Tolerance: ±1%; Temperature Coefficient: ±100ppm/℃; Operating Temperature Range: -55℃~+155℃
USB1 = YTC-TC8S-125: Connector Type:Type-C Standard:- Gender:Female Number of Ports:1 Number of Contacts:8P Mounting Style:Brick nogging Current Rating - Power (Max):5A Operating Temperature Range:-20℃~+85℃ Operating Temperature Range:-20℃~+85℃; LCSC Part Name: Type-C 母 立贴; Supplier Part: C2927289; Manufacturer: YIYUAN(怡远); Supplier Footprint: SMD; JLCPCB Part Class: Extended Part; Datasheet: https://atta.szlcsc.com/upload/public/pdf/source/20211202/3D9DC3A0384F0251D66BF336C0261F55.pdf; Supplier: LCSC; Connector Type: Type-C; Gender: Female; Number of Ports: 1; Number of Contacts: 8P; Mounting Style: Brick nogging; Current Rating - Power (Max): 5A; Operating Temperature Range: -20℃~+85℃

## Nets
1V8: C10.1 C12.1 C13.1 C14.1 L1.1 L7.2 U3.C2(VOS) U9.5(IN) U9.6(EN)
+3V3: C3.1 C4.2 C9.1 C11.1 C20.2 C28.1 C29.1 F1.2 H1.2 J2.1(VIO) R2.2 R3.2 R4.2 R5.2 R6.2 R7.2 R8.2 R9.2 R10.2 R11.2 R12.2 R14.2 U2.5(VDD_IO) U2.8(VDD) U4.1(VCC) U5.36(VDD) U5.37(VDD) U7.1 U9.1(OUT) U13.2(VCC) USD1.4(VDD)
GND: BAT1.2 C1.2 C2.2 C3.2 C4.1 C7.2 C8.2 C9.2 C10.2 C11.2 C12.2 C13.2 C14.2 C15.1 C16.1 C18.1 C20.1 C23.1 C24.2 C25.1 C26.1 C27.1 C28.2 C29.2 C31.2 CN1.0(MOUNTING) CN1.3(GND) CN1.5(GND) CN1.6(GND) CN1.11(GND) CN1.18(GND) CN1.33(GND) CN1.39(GND) CN1.45(GND) CN1.51(GND) CN1.57(GND) CN1.71(GND) CN1.73(GND) CN1.76 CN1.77 D2.2(A) D4.2 E1.2 H1.3 J2.2(GND) L5.2 L6.2 NSIM1.1(EP) NSIM1.2(EP) NSIM1.3(EP) NSIM1.4(EP) NSIM1.C5(GND) R15.2 R19.1 R24.1 R31.2 SW1.1 U2.1(SDO/SA0) U2.6(GND) U2.7(GND) U3.B2(GND) U3.D1(CTRL) U4.3(GND) U4.7(AD1) U4.8(AD0) U5.1(GND) U5.22(GND) U5.38(GND) U5.39(GND) U5.47(GND) U5.59(GND) U7.3 U7.5 U7.9 U9.3(GND) U11.2 U11.3 U11.4 U12.2 U12.3 U12.4 U13.1(GND) U13.4(GNDRF) USB1.10(EH) USB1.11(EH) USB1.A8(SUB1) USB1.A12(GND) USB1.B12(GND) USD1.6(VSS) USD1.9 USD1.10 USD1.11 USD1.12 USD1.13 USD1.14
VBAT: BAT1.1 C30.1 D1.1(A) D1.2(A)
I_CS: R2.1 U2.12(CS)
I_SCL: R3.1 U2.13(SCL) U5.53(~D42)
I_SDA: R4.1 U2.14(SDA) U5.52(~D43)
NC_SCL: CN1.40(SCL_P) R5.1 U4.4(SCL) U5.4(~D39)
NC_SDA: CN1.42(SDA_P) R6.1 U4.5(SDA) U5.5(D40)
NRESET: C7.1 CN1.50(AUX3) R14.1 U5.50(nRESET) U7.10
PT_CS: J2.7(CS) U5.56(D38)
SD_CD: R7.1 U5.14(~AD35) USD1.2(CD/DAT3)
SD_MISO: J2.5(SDO) R9.1 U5.23(MISO ~D6) USD1.7(DAT0)
SD_MOSI: J2.6(SDI) R8.1 U5.13(MOSI ~D7) USD1.3(CMD)
SD_SCK: J2.4(CLK) R11.1 U5.12(SCLK ~D5) USD1.5(CLK)
SIM_CLK: CN1.14(SIM_CLK) R28.1
SIM_DAT2: R12.1 USD1.1(DAT2)
SIM_IO: CN1.12(SIM_IO) R27.1
SIM_RST: CN1.10(SIM_RST) R29.1
SIM_VCC: C24.1 CN1.8(SIM_VCC) D4.6 NSIM1.C1(VCC) R30.2
SWDCLK: U5.2(D20 SWDCK) U7.4
SWDIO: U5.10(D21 SWDIO) U7.2
SWO: U5.30(~AD33) U7.6
USBD+: CN1.7(USB_DP) R17.2
USBD-: CN1.9(USB_DN) R16.2
VACT_GPS_OUT: CN1.20(VACT_GPS_OUT) R23.2
VMAIN: C15.2 C23.2 D1.3(K) D2.1(C) D3.1(K) F2.2 R18.2 U3.A2(VIN) U3.C1(VSEL)
VUSB: CN1.13(VUSB) D3.2(A) USB1.A9(VBUS) USB1.B9(VBUS)
$1N5: CN1.70(VMODEM_P) CN1.72(VMODEM_P) CN1.74(VMODEM_P) F2.1
$1N27: CN1.16(SIM_NPRESENT) R31.1
$1N1900: U12.1 U13.3(AO)
$1N1978: C19.2 E1.4
$1N2069: L3.1 U13.5(AI)
$1N2072: C17.1 L3.2
$1N2075: C17.2 R22.1
$1N2105: C18.2 C19.1 R22.2
$1N2207: R23.1 R24.2 U13.6(PON)
$1N3253: R20.1 U11.1
$1N3261: R20.2 R21.1
$1N3308: L2.2 U14.1
$1N3573: R26.2 U14.6
$1N3674: C22.1 L4.1 U14.2
$1N3697: C16.2 C21.1 L5.1 R21.2
$1N3711: C21.2 L2.1 L6.1
$1N3824: CN1.2(VIO_P) CN1.4(VIO_P) F1.1
$1N9740: C22.2 L4.2 U14.3
$1N9751: R26.1 U14.5
$2N3: R10.1 USD1.8(DAT1)
$2N34: H1.1 U4.2(I0)
$3N3: C2.1 U5.34(XO) U6.2(GND)
$3N4: C1.1 U5.35(XI) U6.1
$4N6: L1.2 U3.A1(SW)
$4N11: L7.1 U9.2(LX)
$4N1576: R19.2 U9.4(SEL)
$4N2482: C8.1 R18.1 SW1.2 U3.B1(EN)
$5N369: R15.1 USB1.A5(CC1)
$5N370: R17.1 USB1.B6(DP2)
$5N371: R16.1 USB1.B7(DN2)
$5N5765: C25.2 D4.5 NSIM1.C2(RST) R29.2
$5N5772: C26.2 D4.4 NSIM1.C3(CLK) R28.2
$5N5779: C27.2 D4.3 NSIM1.C7(I/O) R27.2 R30.1
Net-(C30-2): C30.2 C31.1

Not connected (* = marked no-connect by the designer): CN1 1(NC)* 15(NC)* 17(NC)* 19(NC)* 21(NC)* 22(VACT_GPS_IN)* 23(NC)* 32(NC)* 34(NC)* 35(NC)* 36(NC)* 37(NC)* 38(AUX5)* 41(NC)* 43(NC)* 44(NC)* 46(AUX1)* 47(NC)* 48(AUX2)* 49(NC)* 52(AUX4)* 53(NC)* 54(ATTN_P)* 55(NC)* 56(AUX_EN_P)* 58(AUX_RX_P)* 59(NC)* 60(AUX_TX_P)* 61(NC)* 62(RX_P)* 63(NC)* 64(TX_P)* 65(NC)* 66(NC)* 67(NRST)* 68(NC)* 69(NC)* 75(NC)*; D4 1; E1 3*; J2 3(3V3 out)* 8(RDY)*; NSIM1 C6(Vpp)*; U2 2(SDX)* 3(SCX)* 4(INT1)* 9(INT2)* 10(OCS_AUX)* 11(SDO_AUX)*; U3 D2(LOAD)*; U4 6(PCTLZ)*; U5 3(~D49 RX0)* 6(SDA D9)* 7(~BOOT)* 8(D10)* 9(~D48 TX0)* 11(SCL D8)* 15(~D4)* 16(~D24)* 17(~D22)* 18(~D23)* 19(~D27)* 20(D14)* 21(~D28)* 24(~AD32)* 25(~D25)* 26(~AD12)* 27(~D26)* 28(~AD13)* 29(D15)* 31(AD34)* 32(~AD11)* 33(~AD29)* 40(~D19)* 41(~D18)* 42(AD16)* 43(D17)* 44(~AD31)* 45(D41)* 46(~D45)* 48(D2)* 49(D1)* 51(D0)* 54(D3)* 55(D36)* 57(~D37)* 58(~D44)*; U7 7* 8*; U14 4* 7*

## Notes on the sheets
sheet 1
- LTE
- VIO on Notecarrier supplies VCC on the rest of the components.
- Notecard can pulse AUX3 low to reset Artemis.
- GPS
sheet 2
- PT100/1000
- SD card
- MAX31865 (adafruit)
- DI
- DO
- 1-Wire to I2C mux
- SQ
sheet 3
- JTAG / SWD debug & programmer
